# EAGLE design area-mon (EAGLE 6.1)
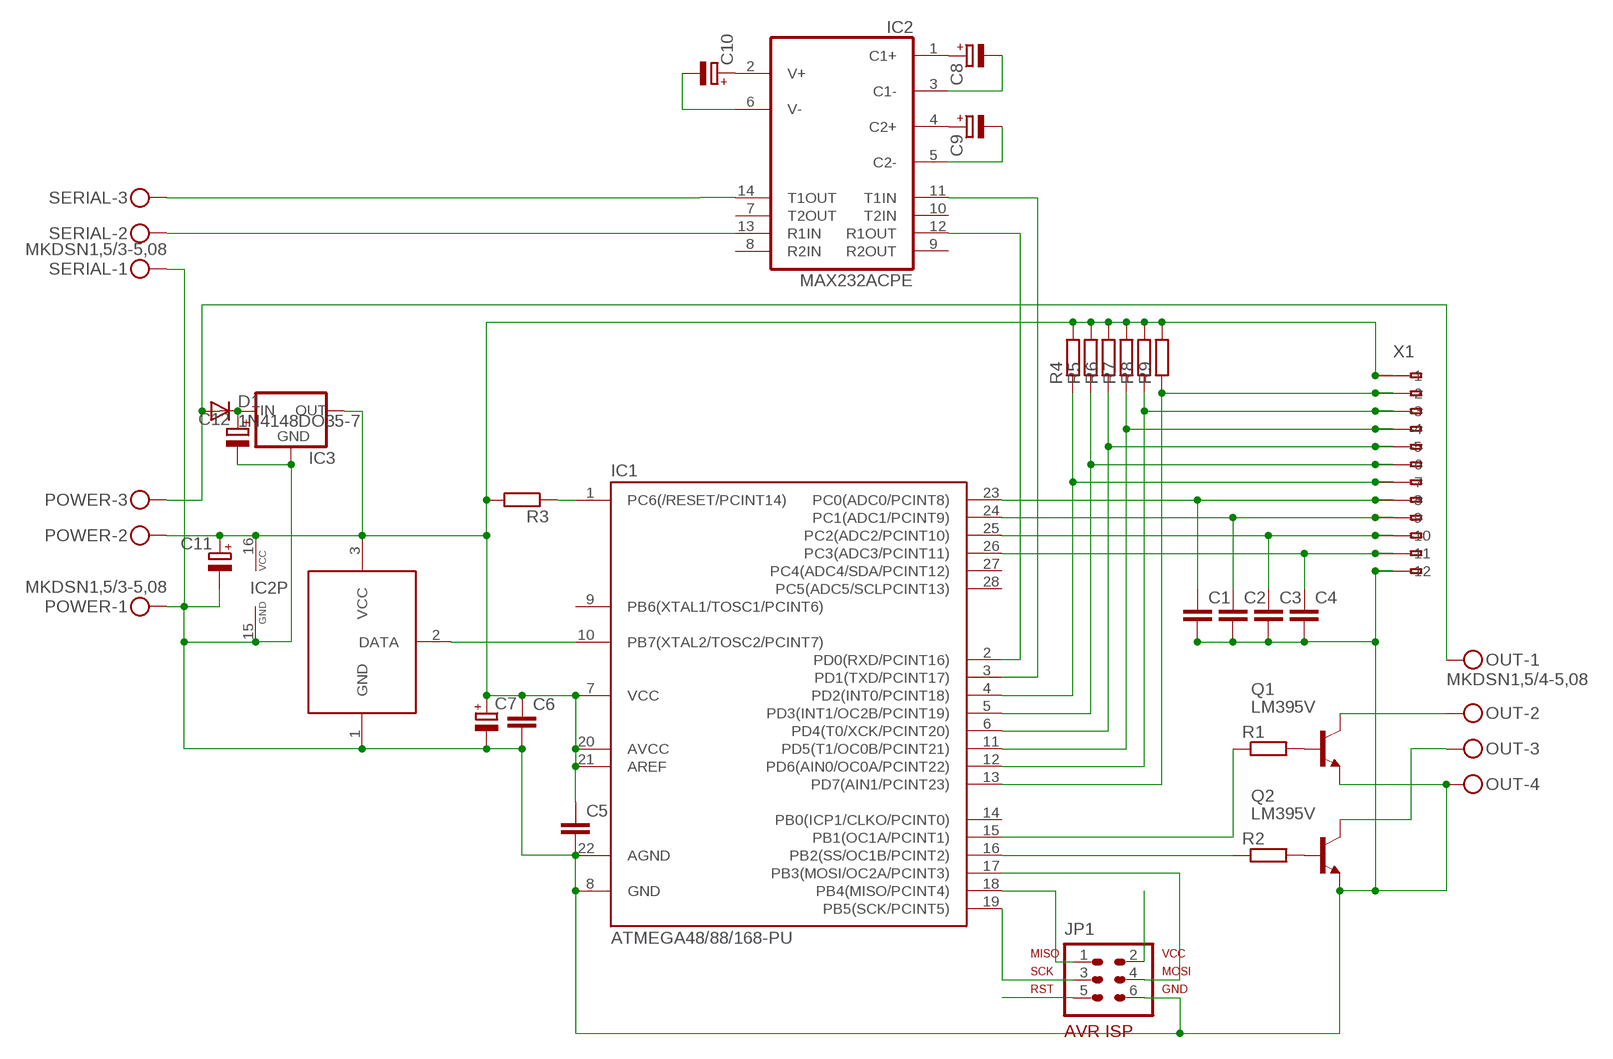
[diagram p0: schematic, sheet 1]

## Parts
C1  C-EU050-024X044  [C050-024X044]
C2  C-EU050-024X044  [C050-024X044]
C3  C-EU050-024X044  [C050-024X044]
C4  C-EU050-024X044  [C050-024X044]
C5  C-EU050-024X044  [C050-024X044]
C6  C-EU050-024X044  [C050-024X044]
C7  CPOL-EUE5-8.5  [E5-8,5]
C8  CPOL-EUE2.5-5  [E2,5-5]
C9  CPOL-EUE2.5-5  [E2,5-5]
C10  CPOL-EUE2.5-5  [E2,5-5]
C11  CPOL-EUE2.5-5  [E2,5-5]
C12  CPOL-EUE2.5-5  [E2,5-5]
D1  1N4148DO35-7  [DO35-7]
IC1  ATMEGA48/88/168-PU  [DIL28-3]
IC2  MAX232ACPE  [DIL16]
IC3  78XXTO92L  [TO92L]
JP1  AVR-ISP-6VERT  [AVR-ISP-6]
OUT  MKDSN1,5/4-5,08  [MKDSN1,5/4-5,08]
POWER  MKDSN1,5/3-5,08  [MKDSN1,5/3-5,08]
Q1  LM395V  [TO220V]
Q2  LM395V  [TO220V]
R1  R-EU0207/10  [0207/10]
R2  R-EU0207/10  [0207/10]
R3  R-EU0207/10  [0207/10]
R4  R-EU0207/10  [0207/10]
R5  R-EU0207/10  [0207/10]
R6  R-EU0207/10  [0207/10]
R7  R-EU0207/10  [0207/10]
R8  R-EU0207/10  [0207/10]
R9  R-EU0207/10  [0207/10]
SERIAL  MKDSN1,5/3-5,08  [MKDSN1,5/3-5,08]
U$4  DS18B20  [TO92-]
X1  233-512  [233-512]

## Nets
1WIRE: IC1.10(PB7(XTAL2/TOSC2/PCINT7)) U$4.2(DATA)
GND: C1.2 C2.2 C3.2 C4.2 C5.2 C6.2 C7.- C11.- C12.- IC1.8(GND) IC1.22(AGND) IC2.15(GND) IC3.2(GND) JP1.6 OUT.4 POWER.1 Q1.C(E) Q2.C(E) SERIAL.1 U$4.1(GND) X1.A12(-12) X1.B12(B-12)
MISO: IC1.18(PB4(MISO/PCINT4)) JP1.1
MON-A-1: C1.1 IC1.23(PC0(ADC0/PCINT8)) X1.A8(-8) X1.B8(B-8)
MON-A-2: C2.1 IC1.24(PC1(ADC1/PCINT9)) X1.A9(-9) X1.B9(B-9)
MON-A-3: C3.1 IC1.25(PC2(ADC2/PCINT10)) X1.A10(-10) X1.B10(B-10)
MON-A-4: C4.1 IC1.26(PC3(ADC3/PCINT11)) X1.A11(-11) X1.B11(B-11)
MON-D-1: IC1.13(PD7(AIN1/PCINT23)) R9.1 X1.A2(-2) X1.B2(B-2)
MON-D-2: IC1.12(PD6(AIN0/OC0A/PCINT22)) R8.1 X1.A3(-3) X1.B3(B-3)
MON-D-3: IC1.11(PD5(T1/OC0B/PCINT21)) R7.1 X1.A4(-4) X1.B4(B-4)
MON-D-4: IC1.6(PD4(T0/XCK/PCINT20)) R6.1 X1.A5(-5) X1.B5(B-5)
MON-D-5: IC1.5(PD3(INT1/OC2B/PCINT19)) R5.1 X1.A6(-6) X1.B6(B-6)
MON-D-6: IC1.4(PD2(INT0/PCINT18)) R4.1 X1.A7(-7) X1.B7(B-7)
MOSI: IC1.17(PB3(MOSI/OC2A/PCINT3)) JP1.4
N$1: Q1.B R1.2
N$2: Q2.B R2.2
N$3: D1.A OUT.1 POWER.3
N$12: OUT.2 Q1.E(C)
N$13: OUT.3 Q2.E(C)
N$23: C8.+ IC2.1(C1+)
N$24: C9.+ IC2.4(C2+)
N$26: C9.- IC2.5(C2-)
N$27: C8.- IC2.3(C1-)
N$30: C10.+ IC2.2(V+)
N$31: C10.- IC2.6(V-)
N$32: C12.+ D1.C IC3.1(IN)
OUT-CH-1: IC1.15(PB1(OC1A/PCINT1)) R1.1
OUT-CH-2: IC1.16(PB2(SS/OC1B/PCINT2)) R2.1
RST: IC1.1(PC6(/RESET/PCINT14)) JP1.5 R3.1
RX-232: IC2.13(R1IN) SERIAL.2
RXD: IC1.2(PD0(RXD/PCINT16)) IC2.12(R1OUT)
SCK: IC1.19(PB5(SCK/PCINT5)) JP1.3
TX-232: IC2.14(T1OUT) SERIAL.3
TXD: IC1.3(PD1(TXD/PCINT17)) IC2.11(T1IN)
VCC: C5.1 C6.1 C7.+ C11.+ IC1.7(VCC) IC1.20(AVCC) IC1.21(AREF) IC2.16(VCC) IC3.3(OUT) JP1.2 POWER.2 R3.2 R4.2 R5.2 R6.2 R7.2 R8.2 R9.2 U$4.3(VCC) X1.A1(-1) X1.B1(B-1)
Unconnected: IC1.9(PB6(XTAL1/TOSC1/PCINT6)) IC1.14(PB0(ICP1/CLKO/PCINT0)) IC1.27(PC4(ADC4/SDA/PCINT12)) IC1.28(PC5(ADC5/SCLPCINT13)) IC2.7(T2OUT) IC2.8(R2IN) IC2.9(R2OUT) IC2.10(T2IN)

## Library data of the parts
C1-C6 = rcl-2:C-EU: CAPACITOR, European symbol
C7-C12 = rcl-2:CPOL-EU: POLARIZED CAPACITOR, European symbol
D1 = diode:1N4148: DIODE high speed (Philips)
IC1 = atmel:ATMEGA48/88/168-PU
IC2 = maxim-11a:MAX232*: RS232 TRANSCEIVER
IC3 = v-reg-3:78XX: POSITIVE FIXED VOLTAGE REGULATOR
JP1 = atmel:AVR-ISP-6: AVR ISP-6 Serial Programming Header
OUT = con-phoenix-508:MKDSN1,5/4-5,08: MKDSN 1,5/ 4-5,08 Printklemme Nennstrom: 13,5 A Nennspannung: 250 V Rastermaß: 5,08 mm Polzahl: 4 Anschlussart: Schraubanschluss Montage: Löten Anschlussrichtung Leiter/Platine: 0 ° Artikelnummer: 1729144 Source: http://eshop.phoenixcontact.com .. 1729144.pdf
POWER SERIAL = con-phoenix-508:MKDSN1,5/3-5,08: MKDSN 1,5/ 3-5,08 Printklemme Nennstrom: 13,5 A Nennspannung: 250 V Rastermaß: 5,08 mm Polzahl: 3 Anschlussart: Schraubanschluss Montage: Löten Anschlussrichtung Leiter/Platine: 0 ° Artikelnummer: 1729131 Source: http://eshop.phoenixcontact.com .. 1729131.pdf
Q1 Q2 = national-semiconductor:LM395: "Indestructible" NPN Transistor, over-current and over-temperature protected
R1-R9 = rcl-2:R-EU: RESISTOR, European symbol
U$4 = maxim-11a:DS18B20: Precision Thermometer with 1-Wire output
X1 = con-wago-256:233-512: WAGO; MF: Wago Corporation; MPN: 0233-0512; OC_FARNELL: 1777102; OC_NEWARK: 79K2055

## Board
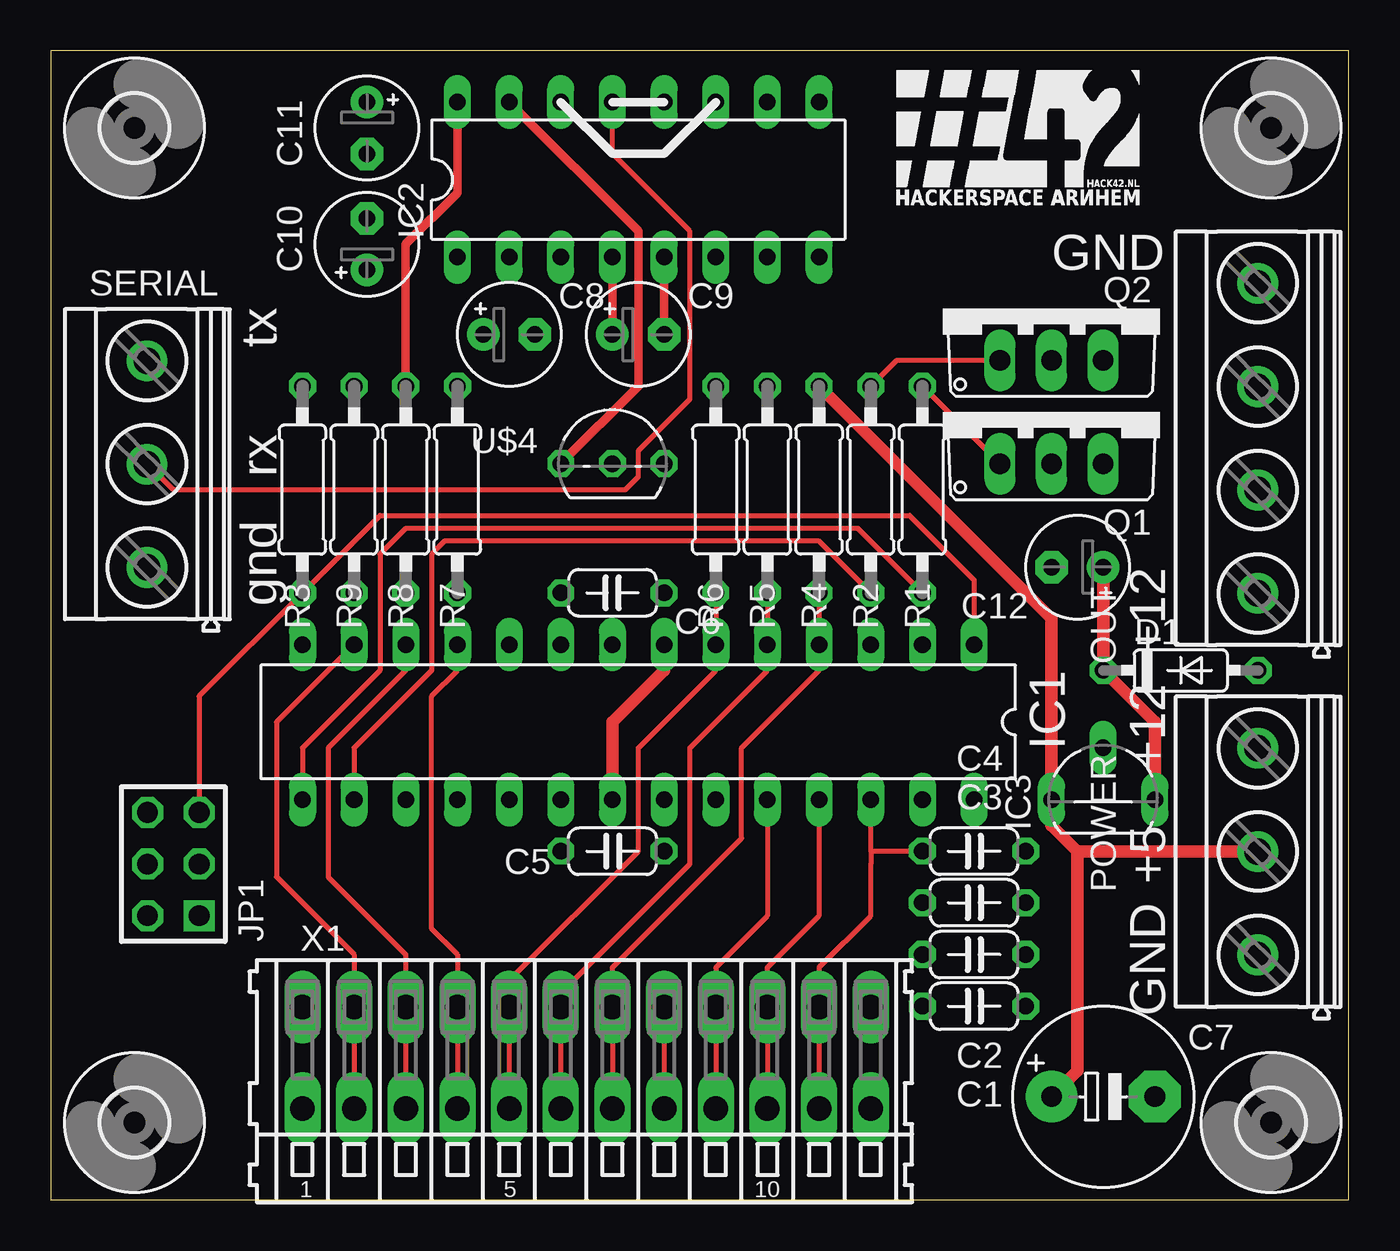
[diagram p1: board, top side]
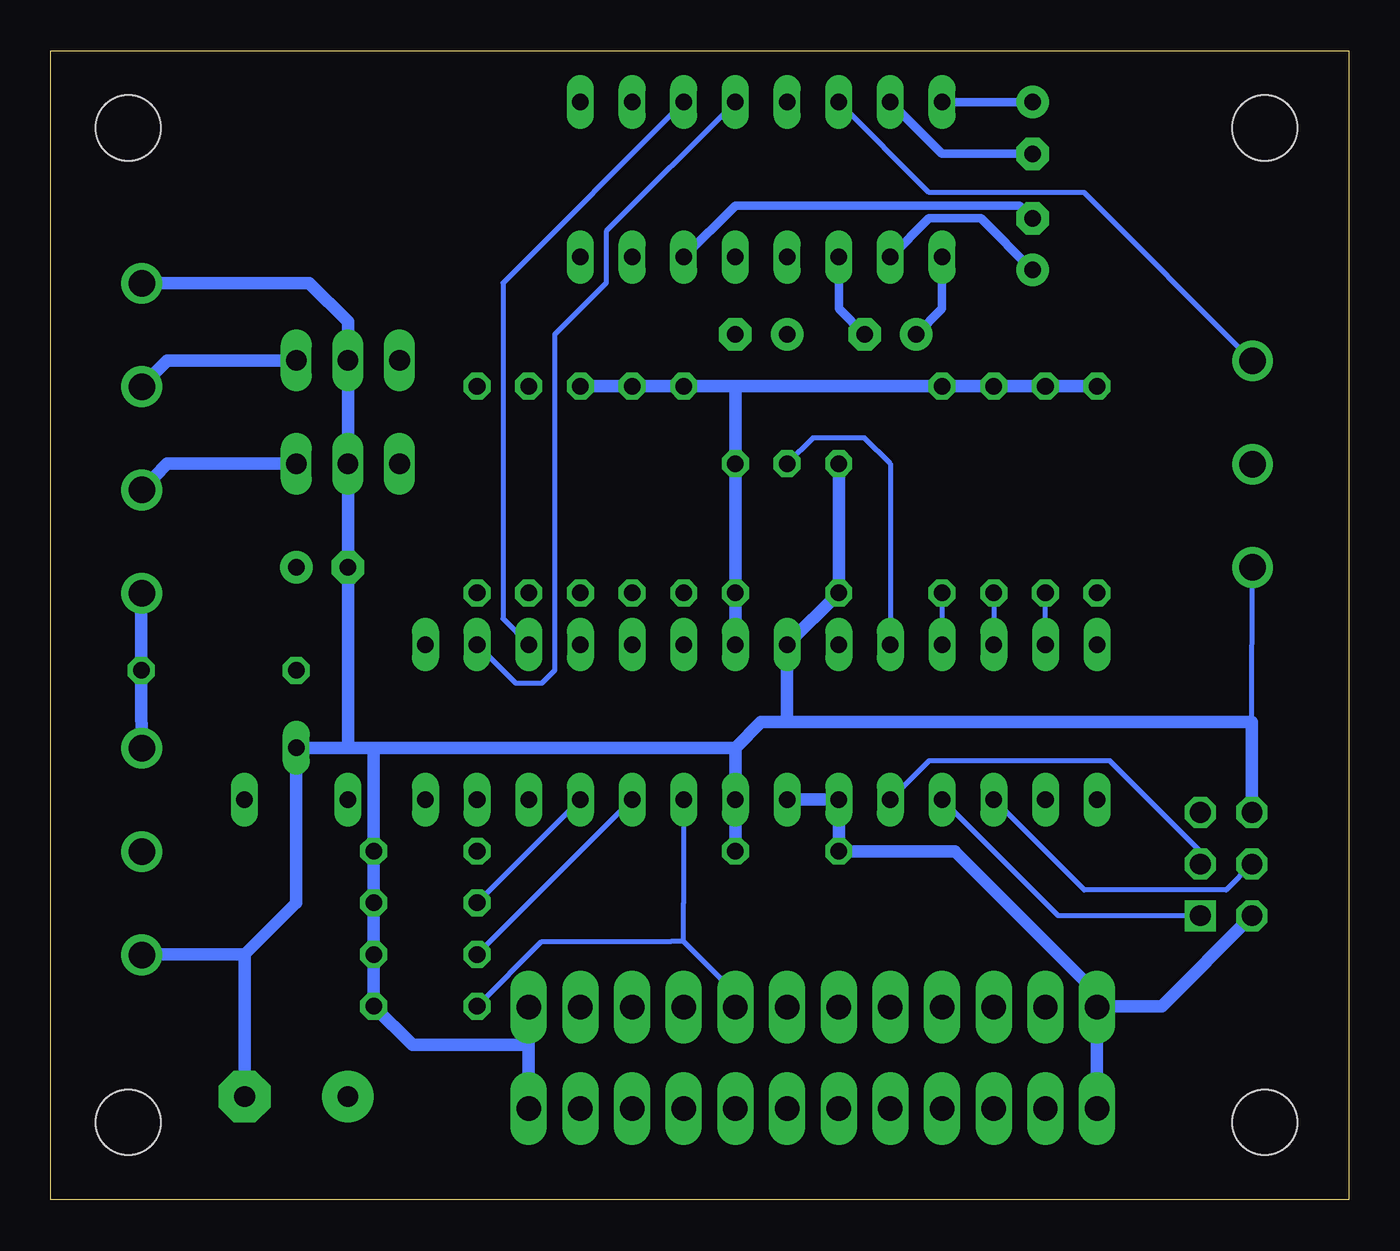
[diagram p2: board, bottom side, seen from below]

Size 63.81 x 56.49 mm. Coordinates in mm from the lower left corner, seen from the top.
Outline: 63.81,0 63.81,56.49 0,56.49 0,0 63.81,0
Copper layers (1*16): Top 0.035mm / dielectric 1.5mm / Bottom 0.035mm
Design rules: minimum track width 10mil, minimum drill 24mil, track to track 8mil, track to pad 8mil, pad to pad 8mil, via to via 8mil, smd to smd 8mil, copper to edge 40mil, drill to drill 8mil, minimum pad ring 10mil, minimum via ring 8mil, stop-mask expansion 4mil, vias tented up to drill 0mil, thermal gap 10mil

### Footprints (pad centres in the part's own frame; a part is rotated, then mirrored left to right if it is on the bottom)
C050-024X044 = drill 0.813 octagon: 1 -2.54,0; 2 2.54,0
E5-8,5 = drill 1.016 pad 2.54: + -2.54,0 | drill 1.016 pad 2.54 octagon: - 2.54,0
E2,5-5 = drill 0.813 pad 1.6: + -1.27,0 | drill 0.813 pad 1.6 octagon: - 1.27,0
DO35-7 = drill 0.813 octagon: A 3.81,0; C -3.81,0
DIL28-3 = drill 0.813 long: 1 -16.51,-3.81; 2 -13.97,-3.81; 3 -11.43,-3.81; 4 -8.89,-3.81; 5 -6.35,-3.81; 6 -3.81,-3.81; 7 -1.27,-3.81; 8 1.27,-3.81; 9 3.81,-3.81; 10 6.35,-3.81; 11 8.89,-3.81; 12 11.43,-3.81; 13 13.97,-3.81; 14 16.51,-3.81; 15 16.51,3.81; 16 13.97,3.81; 17 11.43,3.81; 18 8.89,3.81; 19 6.35,3.81; 20 3.81,3.81; 21 1.27,3.81; 22 -1.27,3.81; 23 -3.81,3.81; 24 -6.35,3.81; 25 -8.89,3.81; 26 -11.43,3.81; 27 -13.97,3.81; 28 -16.51,3.81
DIL16 = drill 0.813 long: 1 -8.89,-3.81; 2 -6.35,-3.81; 3 -3.81,-3.81; 4 -1.27,-3.81; 5 1.27,-3.81; 6 3.81,-3.81; 7 6.35,-3.81; 8 8.89,-3.81; 9 8.89,3.81; 10 6.35,3.81; 11 3.81,3.81; 12 1.27,3.81; 13 -1.27,3.81; 14 -3.81,3.81; 15 -6.35,3.81; 16 -8.89,3.81
TO92L = drill 0.813 long: 1 0,-2.54; 2 2.54,0; 3 0,2.54
AVR-ISP-6 = drill 1.016 square: 1 -2.54,-1.27 | drill 1.016 octagon: 2 -2.54,1.27; 3 0,-1.27; 4 0,1.27; 5 2.54,-1.27; 6 2.54,1.27
MKDSN1,5/4-5,08 = drill 1.3 pad 2: 1 -7.641,0.025; 2 -2.561,0.025; 3 2.519,0.025; 4 7.599,0.025
MKDSN1,5/3-5,08 = drill 1.3 pad 2: 1 -7.641,0.025; 2 -2.561,0.025; 3 2.519,0.025
TO220V = drill 1.016 long: B -2.54,-2.54; C 0,-2.54; E 2.54,-2.54
0207/10 = drill 0.813 octagon: 1 -5.08,0; 2 5.08,0
3,2 = hole 3.2: 0,0
TO92- = drill 0.813 octagon: 1 -2.54,0; 2 0,0; 3 2.54,0
233-512 = drill 1.2 long: A1 -13.97,2.5; A2 -11.43,2.5; A3 -8.89,2.5; A4 -6.35,2.5; A5 -3.81,2.5; A6 -1.27,2.5; A7 1.27,2.5; A8 3.81,2.5; A9 6.35,2.5; A10 8.89,2.5; A11 11.43,2.5; A12 13.97,2.5; B1 -13.97,-2.5; B2 -11.43,-2.5; B3 -8.89,-2.5; B4 -6.35,-2.5; B5 -3.81,-2.5; B6 -1.27,-2.5; B7 1.27,-2.5; B8 3.81,-2.5; B9 6.35,-2.5; B10 8.89,-2.5; B11 11.43,-2.5; B12 13.97,-2.5

### Placement (x,y rotation side)
C1  45.39,9.53 0 top
C2  45.39,12.06 0 top
C3  45.39,14.61 0 top
C4  45.39,17.14 0 top
C5  27.61,17.14 0 top
C6  27.61,29.84 180 top
C7  51.74,5.08 0 top
C8  22.53,42.55 0 top
C9  28.88,42.55 0 top
C10  15.54,46.99 90 top
C11  15.54,52.7 270 top
C12  50.47,31.11 180 top
D1  55.55,26.04 0 top
IC1  28.88,23.5 180 top
IC2  28.88,50.16 0 top
IC3  51.74,19.68 90 top
JP1  6.02,16.51 90 top
OUT  59.36,37.47 90 top
POWER  59.36,19.68 90 top
Q1  49.2,38.73 0 top
Q2  49.2,43.81 0 top
R1  42.85,34.92 90 top
R2  40.31,34.92 90 top
R3  12.37,34.92 90 top
R4  37.77,34.92 90 top
R5  35.23,34.92 90 top
R6  32.69,34.92 90 top
R7  19.99,34.92 90 top
R8  17.45,34.92 90 top
R9  14.91,34.92 90 top
SERIAL  4.75,38.73 90 top
U$1  [3,2]  60,3.81 0 top
U$2  [3,2]  4.12,3.81 0 top
U$3  [3,2]  60,52.7 0 top
U$4  27.61,36.2 0 top
U$5  [3,2]  4.12,52.7 0 top
U$6  [LOGO_HACK42-12X7]  41.58,48.9 0 top
X1  26.34,6.99 0 top

### Tracks (layer width: path | path; a pad name or v marks a point on that pad's centre or on a via)
1WIRE
  Bottom 0.254: IC1.10 22.53,36.2 23.8,37.47 26.34,37.47 U$4.2
GND
  Top 0.406: IC2.15 28.88,47.62 28.88,40.01 U$4.1
  Bottom 0.254: 4.75,23.5 SERIAL.1
  Bottom 0.406: C11.- 19.99,51.44 IC2.15
  Bottom 0.61: 30.15,22.23 28.88,23.5 27.61,23.5 | OUT.4 58.09,45.09 51.11,45.09 49.2,43.18 Q2.C Q1.C C12.- 49.2,22.23 | 49.2,22.23 IC3.2 51.74,14.61 54.28,12.06 | 27.61,23.5 4.75,23.5 JP1.6 | 27.61,23.5 IC1.8 C6.2 U$4.1 | C5.2 IC1.22 30.15,22.23 | 54.28,12.06 58.73,12.06 POWER.1 | C7.- 54.28,12.06 | 49.2,22.23 47.93,22.23 | 47.93,22.23 30.15,22.23 | 47.93,22.23 C4.2 C3.2 C2.2 C1.2 46.02,7.62 40.31,7.62 | X1.A12 40.31,7.62 | X1.B12 40.31,7.62
MISO
  Bottom 0.254: IC1.18 14.28,13.97 JP1.1
MON-A-1
  Top 0.254: X1.B8 30.15,5.08 30.15,8.89 X1.A8
  Bottom 0.254: 32.69,12.7 32.69,14.61 IC1.23 | 32.69,12.7 30.15,10.16 X1.A8 | 32.69,12.7 33.33,12.7 39.68,12.7 C1.1
MON-A-2
  Top 0.254: X1.B9 32.69,5.08 32.69,8.89 X1.A9 32.69,11.43 34.59,13.34 35.23,13.97 IC1.24
  Bottom 0.254: C2.1 IC1.24
MON-A-3
  Top 0.254: X1.B10 35.23,5.08 35.23,8.89 X1.A10 35.23,9.53 35.23,11.43 37.77,13.97 IC1.25
  Bottom 0.254: C3.1 IC1.25
MON-A-4
  Top 0.254: C4.1 40.31,17.14 | 40.31,17.14 IC1.26 40.31,17.14 | X1.B11 37.77,5.08 37.77,8.89 X1.A11 37.77,11.43 40.31,13.97 40.31,16.51 40.31,17.14
MON-D-1
  Top 0.254: IC1.13 11.1,23.5 11.1,15.88 14.91,12.06 X1.A2 X1.B2
  Bottom 0.254: IC1.13 R9.1
MON-D-2
  Top 0.254: IC1.12 17.45,26.04 13.64,22.23 13.64,15.88 17.45,12.06 X1.A3 X1.B3
  Bottom 0.254: R8.1 IC1.12
MON-D-3
  Top 0.254: IC1.11 19.99,26.04 18.72,24.77 18.72,13.34 19.99,12.06 X1.A4 X1.B4
  Bottom 0.254: R7.1 IC1.11
MON-D-4
  Top 0.254: R6.1 32.69,29.21 IC1.6 32.69,26.04 28.88,22.23 28.88,17.14 22.53,10.79 22.53,9.53 X1.A5 22.53,8.89 22.53,5.08 X1.B5
MON-D-5
  Top 0.254: R5.1 IC1.5 35.23,26.04 31.42,22.23 31.42,16.51 25.07,10.16 25.07,9.53 X1.A6 25.07,8.89 25.07,5.08 X1.B6
MON-D-6
  Top 0.254: R4.1 IC1.4 37.77,26.67 37.77,26.04 33.96,22.23 33.96,17.78 27.61,11.43 27.61,10.16 X1.A7 27.61,8.89 27.61,5.08 X1.B7
MOSI
  Bottom 0.254: IC1.17 13.01,15.24 6.02,15.24 JP1.4
N$1
  Top 0.254: Q1.B R1.2
N$2
  Top 0.254: R2.2 41.58,41.27 Q2.B
N$3
  Bottom 0.61: OUT.1 59.36,29.84 D1.A 59.36,24.77 POWER.3
N$12
  Bottom 0.61: Q1.E 58.09,36.2 OUT.2
N$13
  Bottom 0.61: Q2.E 58.09,41.27 OUT.3
N$23
  Bottom 0.406: C8.+ 19.99,43.81 19.99,44.45 IC2.1
N$24
  Top 0.406: IC2.4 27.61,45.72 27.61,43.18 C9.+
N$26
  Top 0.406: IC2.5 30.15,45.72 30.15,43.18 C9.-
N$27
  Bottom 0.406: C8.- 25.07,43.81 IC2.3
N$30
  Bottom 0.406: C10.+ 18.09,48.26 20.62,48.26 IC2.2
N$31
  Bottom 0.406: C10.- 16.18,48.9 30.15,48.9 IC2.6
N$32
  Top 0.61: C12.+ D1.C 54.28,23.5 IC3.1
OUT-CH-1
  Top 0.254: R1.1 39.68,33.02 17.45,33.02 16.18,31.75 16.18,26.04 12.37,22.23 IC1.15
OUT-CH-2
  Top 0.254: R2.1 37.77,32.38 19.36,32.38 18.72,31.75 18.72,26.04 14.91,22.23 IC1.16
RST
  Top 0.254: IC1.1 45.39,30.48 42.22,33.66 16.18,33.66 R3.1 7.29,24.77 JP1.5
RX-232
  Top 0.254: IC2.13 27.61,51.44 31.42,47.62 31.42,39.37 28.88,36.83 28.88,35.56 28.25,34.92 6.02,34.92 4.75,36.2 SERIAL.2
RXD
  Bottom 0.254: IC1.2 40.95,25.4 39.68,25.4 39.04,26.04 39.04,42.55 36.5,45.09 36.5,47.62 IC2.12
SCK
  Bottom 0.254: IC1.19 20.62,21.59 11.73,21.59 7.29,17.14 JP1.3
TX-232
  Bottom 0.254: IC2.14 20.62,49.53 13.01,49.53 4.75,41.27 SERIAL.3
TXD
  Bottom 0.254: IC1.3 41.58,28.57 41.58,45.09 IC2.11
VCC
  Top 0.406: R8.2 17.45,46.99 19.99,49.53 IC2.16
  Top 0.61: IC1.21 27.61,23.5 30.15,26.04 IC1.7 | 50.47,17.14 50.47,6.35 C7.+ | 50.47,17.14 49.2,18.41 IC3.3 49.2,28.57 R4.2 | 50.47,17.14 58.73,17.14 POWER.2
  Bottom 0.406: IC2.16 C11.+
  Bottom 0.61: R3.2 R9.2 R8.2 R7.2 30.15,40.01 | R4.2 R5.2 R6.2 30.15,40.01 | IC1.21 IC1.20 C5.1 19.36,17.14 12.37,10.16 X1.A1 | 30.15,40.01 U$4.3 C6.1 IC1.7 | JP1.2 9.2,9.53 12.37,9.53 X1.A1 | X1.B1 X1.A1

### Text on the board
tNames: GND | tx | rx | +12 | gnd | +12 | +5 | GND